# Altium schematic sheet Sheet2.SchDoc
size A4
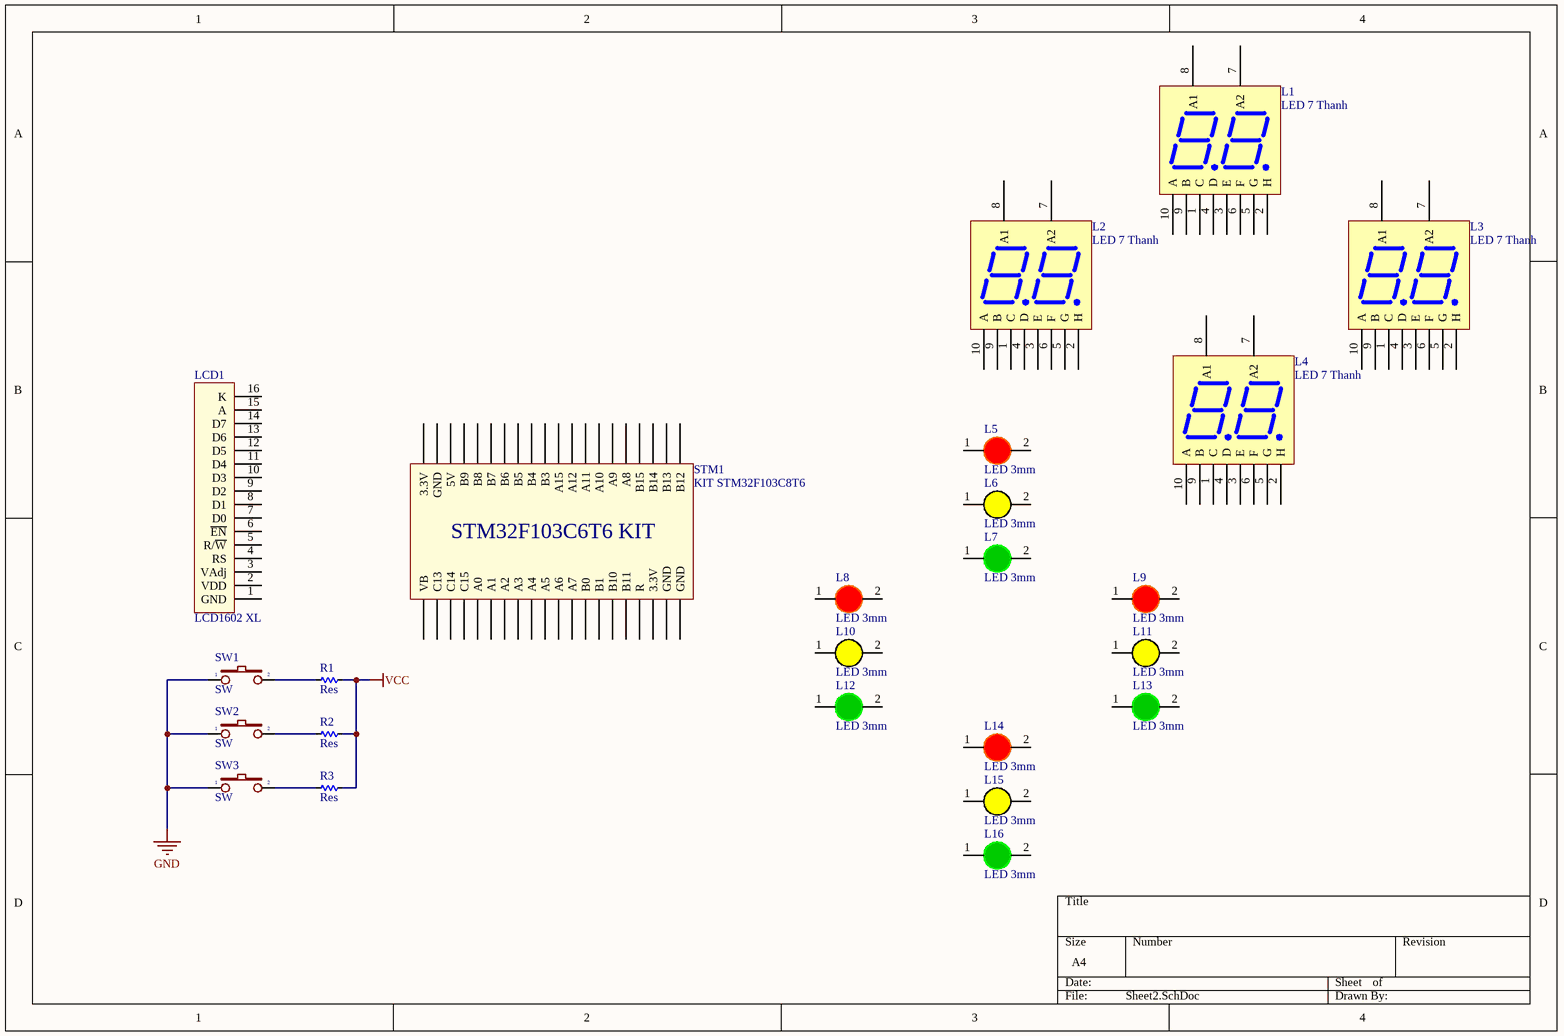
[diagram p0: Sheet2.SchDoc]

## Parts
L1  LED 7 Thanh  [LED 7x2 0.56]
L2  LED 7 Thanh  [LED 7x2 0.56]
L3  LED 7 Thanh  [LED 7x2 0.56]
L4  LED 7 Thanh  [LED 7x2 0.56]
L5  LED 3mm  [LED-3MM-RED]
L6  LED 3mm  [LED-3MM-YELLOW]
L7  LED 3mm  [LED-3MM-GREEN]
L8  LED 3mm  [LED-3MM-RED]
L9  LED 3mm  [LED-3MM-RED]
L10  LED 3mm  [LED-3MM-YELLOW]
L11  LED 3mm  [LED-3MM-YELLOW]
L12  LED 3mm  [LED-3MM-GREEN]
L13  LED 3mm  [LED-3MM-GREEN]
L14  LED 3mm  [LED-3MM-RED]
L15  LED 3mm  [LED-3MM-YELLOW]
L16  LED 3mm  [LED-3MM-GREEN]
LCD1  LCD1602 XL  [LCD1602 with Jump]
R1  Res  [RES-1/2W]
R2  Res  [RES-1/2W]
R3  Res  [RES-1/2W]
STM1  KIT STM32F103C8T6  [STM32F103 KIT]
SW1  SW  [SW1-SMD]
SW2  SW  [SW1-SMD]
SW3  SW  [SW1-SMD]

## Nets
GND: SW1.1 SW2.1 SW3.1
VCC: R1.1 R2.1 R3.1
NetR1_2: R1.2 SW1.2
NetR2_2: R2.2 SW2.2
NetR3_2: R3.2 SW3.2

Not connected (* = marked no-connect by the designer): L1 1(C) 2(H) 3(E) 4(D) 5(G) 6(F) 7(A2) 8(A1) 9(B) 10(A); L2 1(C) 2(H) 3(E) 4(D) 5(G) 6(F) 7(A2) 8(A1) 9(B) 10(A); L3 1(C) 2(H) 3(E) 4(D) 5(G) 6(F) 7(A2) 8(A1) 9(B) 10(A); L4 1(C) 2(H) 3(E) 4(D) 5(G) 6(F) 7(A2) 8(A1) 9(B) 10(A); L5 1(A) 2(K); L6 1(A) 2(K); L7 1(A) 2(K); L8 1(A) 2(K); L9 1(A) 2(K); L10 1(A) 2(K); L11 1(A) 2(K); L12 1(A) 2(K); L13 1(A) 2(K); L14 1(A) 2(K); L15 1(A) 2(K); L16 1(A) 2(K); LCD1 1(GND) 2(VDD) 3(VAdj) 4(RS) 5(R/~{W}) 6(~{EN}) 7(D0) 8(D1) 9(D2) 10(D3) 11(D4) 12(D5) 13(D6) 14(D7) 15(A) 16(K); STM1 1(B12) 2(B13) 3(B14) 4(B15) 5(A8) 6(A9) 7(A10) 8(A11) 9(A12) 10(A15) 11(B3) 12(B4) 13(B5) 14(B6) 15(B7) 16(B8) 17(B9) 18(5V) 19(GND) 20(3.3V) 21(VB) 22(C13) 23(C14) 24(C15) 25(A0) 26(A1) 27(A2) 28(A3) 29(A4) 30(A5) 31(A6) 32(A7) 33(B0) 34(B1) 35(B10) 36(B11) 37(R) 38(3.3V) 39(GND) 40(GND)

## Notes on the sheet
- (in symbol STM32f103 Bluepill) STM32F103C6T6 KIT

## Library data of the parts
L1-L4 = LED 7x2 0.56 Anot: Dán; Don_Vi: Con; Ma_Hang: MH001040; Ten_Linh_Kien: Led 7 0.56 2 Số Anot (Sáng Đỏ; Ghi_Chu: *; Kieu_Chan: *; Chung_Loai: Dán
L5 L8 L9 L14 = LED 3mm Do: Cắm; Don_Vi: Con; Ma_Hang: MH003892; Ten_Linh_Kien: Led 3MM Phủ Đỏ (10c); Ghi_Chu: *; Kieu_Chan: *; Chung_Loai: Cắm
L6 L10 L11 L15 = LED 3mm Vang: Cắm; Don_Vi: Con; Ma_Hang: MH003893; Ten_Linh_Kien: Led 3MM Phủ Vàng (10c); Ghi_Chu: *; Kieu_Chan: *; Chung_Loai: Cắm
L7 L12 L13 L16 = LED 3mm Xanh La: Cắm; Don_Vi: Con; Ma_Hang: MH001054; Ten_Linh_Kien: Led 3MM Phủ Xanh (10c); Ghi_Chu: *; Kieu_Chan: *; Chung_Loai: Cắm
LCD1 = LCD1602 XL: LCD 1602 Xanh Lá; Ten: Màn hình LCD 1602 Xanh Lá; Ma_Hang: 67HZ; NCC: NSHOP; CHIP: HD44780
R1-R3 = Res: Manufacturer: Generic Components; Class: Passive; SubClass: R; Published: 08/06/2000; Publisher: Altium Hobart Technology Centre
STM1 = STM32f103 Bluepill: KIT STM32F103C8T6 Bluepill
SW1-SW3 = SW2: Switch button 2 pin; Value: SW chip 2 pin